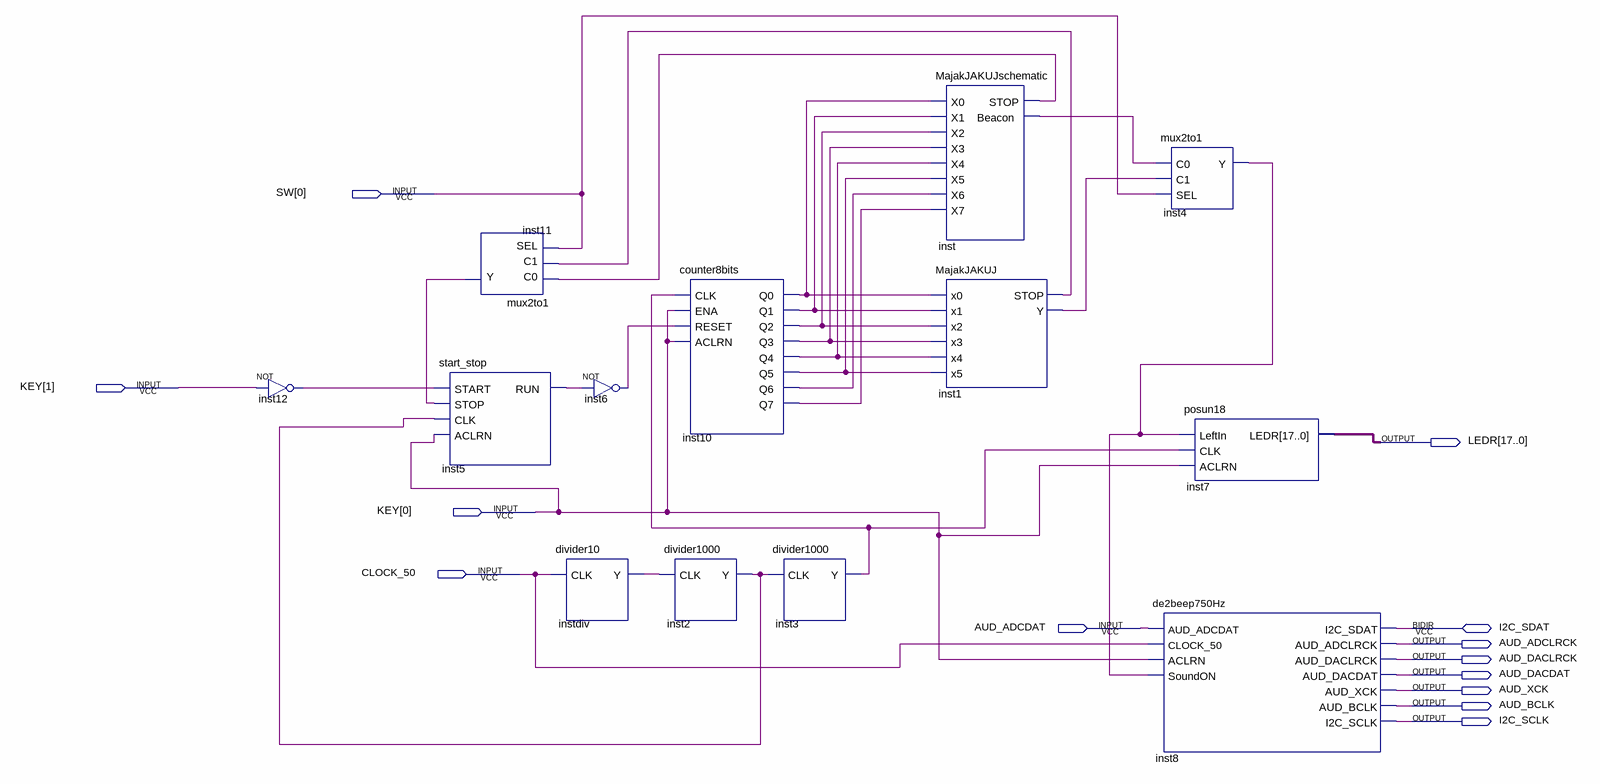
[diagram p0: schematic sheet]
// Quartus schematic NovaBlob.bdf as structural Verilog: 13 symbols, 13 pins
module NovaBlob (
  input  [0:0] SW,
  input  [1:0] KEY,
  input  CLOCK_50,
  input  AUD_ADCDAT,
  inout  I2C_SDAT,
  output [17:0] LEDR,
  output AUD_ADCLRCK,
  output AUD_DACLRCK,
  output AUD_DACDAT,
  output AUD_XCK,
  output AUD_BCLK,
  output I2C_SCLK
);

  wire inst1_stop, inst1_y, inst2_y, inst3_y, inst4_y, inst5_run, inst6_out, inst10_q0, inst10_q1, inst10_q2,
       inst10_q3, inst10_q4, inst10_q5, inst10_q6, inst10_q7, inst11_y, inst12_out, inst_beacon, inst_stop,
       instdiv_y;

  not inst12 (inst12_out, KEY[1]);
  start_stop inst5 (.START(inst12_out), .STOP(inst11_y), .CLK(inst2_y), .ACLRN(KEY[0]), .RUN(inst5_run));
  mux2to1 inst11 (.C0(inst_stop), .C1(inst1_stop), .SEL(SW[0]), .Y(inst11_y));
  divider10 instdiv (.CLK(CLOCK_50), .Y(instdiv_y));
  not inst6 (inst6_out, inst5_run);
  counter8bits inst10 (
    .CLK(inst3_y), .ENA(KEY[0]), .RESET(inst6_out), .ACLRN(KEY[0]), .Q0(inst10_q0), .Q1(inst10_q1),
    .Q2(inst10_q2), .Q3(inst10_q3), .Q4(inst10_q4), .Q5(inst10_q5), .Q6(inst10_q6), .Q7(inst10_q7));
  divider1000 inst2 (.CLK(instdiv_y), .Y(inst2_y));
  divider1000 inst3 (.CLK(inst2_y), .Y(inst3_y));
  MajakJAKUJschematic inst (
    .X0(inst10_q0), .X1(inst10_q1), .X2(inst10_q2), .X3(inst10_q3), .X4(inst10_q4), .X5(inst10_q5),
    .X6(inst10_q6), .X7(inst10_q7), .STOP(inst_stop), .Beacon(inst_beacon));
  MajakJAKUJ inst1 (
    .x0(inst10_q0), .x1(inst10_q1), .x2(inst10_q2), .x3(inst10_q3), .x4(inst10_q4), .x5(inst10_q5),
    .STOP(inst1_stop), .Y(inst1_y));
  mux2to1 inst4 (.C0(inst_beacon), .C1(inst1_y), .SEL(SW[0]), .Y(inst4_y));
  posun18 inst7 (.LeftIn(inst4_y), .CLK(inst3_y), .ACLRN(KEY[0]), .LEDR(LEDR));
  de2beep750Hz inst8 (
    .AUD_ADCDAT(AUD_ADCDAT), .CLOCK_50(CLOCK_50), .ACLRN(KEY[0]), .SoundON(inst4_y),
    .AUD_ADCLRCK(AUD_ADCLRCK), .AUD_DACLRCK(AUD_DACLRCK), .AUD_DACDAT(AUD_DACDAT), .AUD_XCK(AUD_XCK),
    .AUD_BCLK(AUD_BCLK), .I2C_SCLK(I2C_SCLK), .I2C_SDAT(I2C_SDAT));
endmodule
